# EAGLE design oscillator_board (EAGLE 9.0.0)
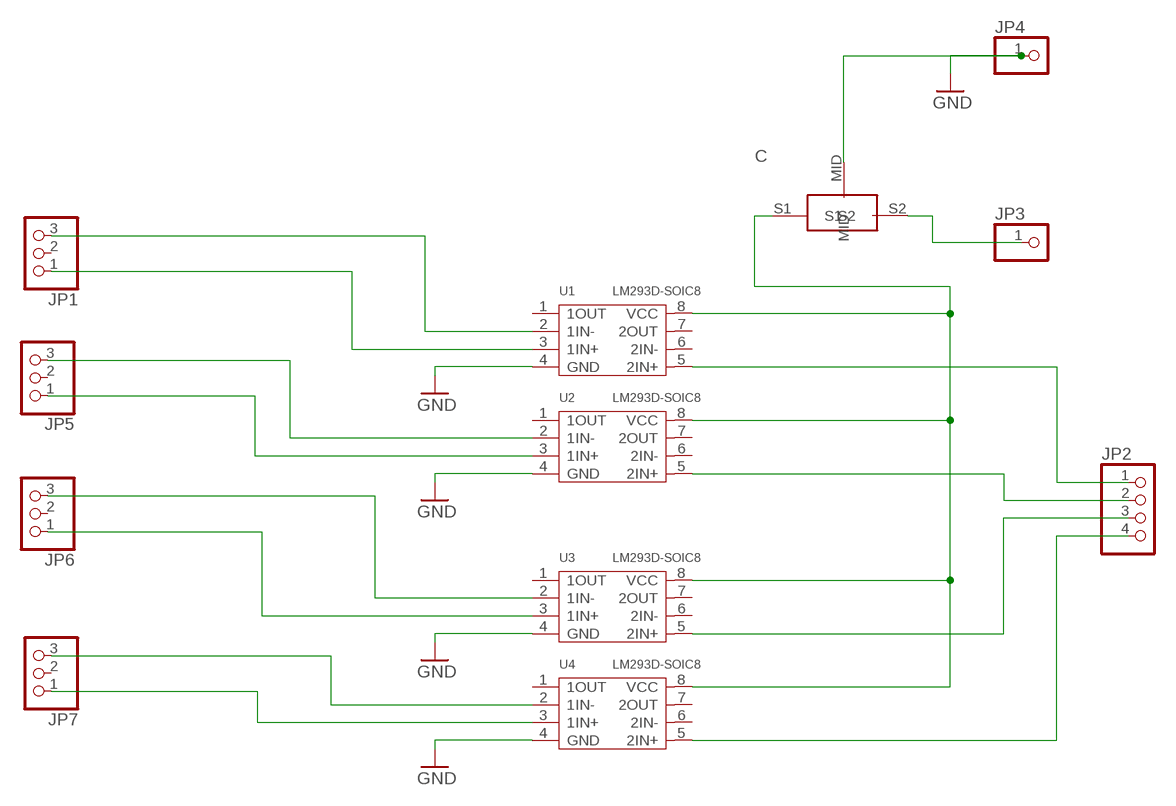
[diagram p0: schematic, sheet 1]

## Parts
JP1  PINHD-1X3  [1X03]
JP2  PINHD-1X4  [1X04]
JP3  PINHD-1X1  [1X01]
JP4  PINHD-1X1  [1X01]
JP5  PINHD-1X3  [1X03]
JP6  PINHD-1X3  [1X03]
JP7  PINHD-1X3  [1X03]
OSCILLATOR1  CSMD  [C]
U1  LM293D-SOIC8  AMPLIFIER-LM293D(SOIC8)  [SOIC8-1.27-5X4MM]
U2  LM293D-SOIC8  AMPLIFIER-LM293D(SOIC8)  [SOIC8-1.27-5X4MM]
U3  LM293D-SOIC8  AMPLIFIER-LM293D(SOIC8)  [SOIC8-1.27-5X4MM]
U4  LM293D-SOIC8  AMPLIFIER-LM293D(SOIC8)  [SOIC8-1.27-5X4MM]

## Nets
GND: JP4.1 OSCILLATOR1.MID U1.4(GND) U2.4(GND) U3.4(GND) U4.4(GND)
N$1: JP1.3 U1.2(1IN-)
N$2: JP1.1 U1.3(1IN+)
N$3: JP5.3 U2.2(1IN-)
N$4: JP5.1 U2.3(1IN+)
N$5: JP6.3 U3.2(1IN-)
N$6: JP6.1 U3.3(1IN+)
N$7: JP7.3 U4.2(1IN-)
N$8: JP7.1 U4.3(1IN+)
N$9: JP2.4 U4.5(2IN+)
N$10: JP2.3 U3.5(2IN+)
N$11: JP2.2 U2.5(2IN+)
N$12: JP2.1 U1.5(2IN+)
N$13: JP3.1 OSCILLATOR1.S2
VCC: OSCILLATOR1.S1 U1.8(VCC) U2.8(VCC) U3.8(VCC) U4.8(VCC)
Unconnected: JP1.2 JP5.2 JP6.2 JP7.2 U1.1(1OUT) U1.6(2IN-) U1.7(2OUT) U2.1(1OUT) U2.6(2IN-) U2.7(2OUT) U3.1(1OUT) U3.6(2IN-) U3.7(2OUT) U4.1(1OUT) U4.6(2IN-) U4.7(2OUT)

## Library data of the parts
JP1 JP5-JP7 = pinhead:PINHD-1X3: PIN HEADER
JP2 = pinhead:PINHD-1X4: PIN HEADER
JP3 JP4 = adafruit:PINHD-1X1: Pin header 1x1 for 0.1" spacing With round pins
OSCILLATOR1 = my-library:C
U1 = Seeed-IC:AMPLIFIER-LM293D(SOIC8): 310020016; MPN: LM293D; SPICEPREFIX: X
U2-U4 = Seeed-IC:AMPLIFIER-LM293D(SOIC8): 310020016; MPN: LM293D

## Board
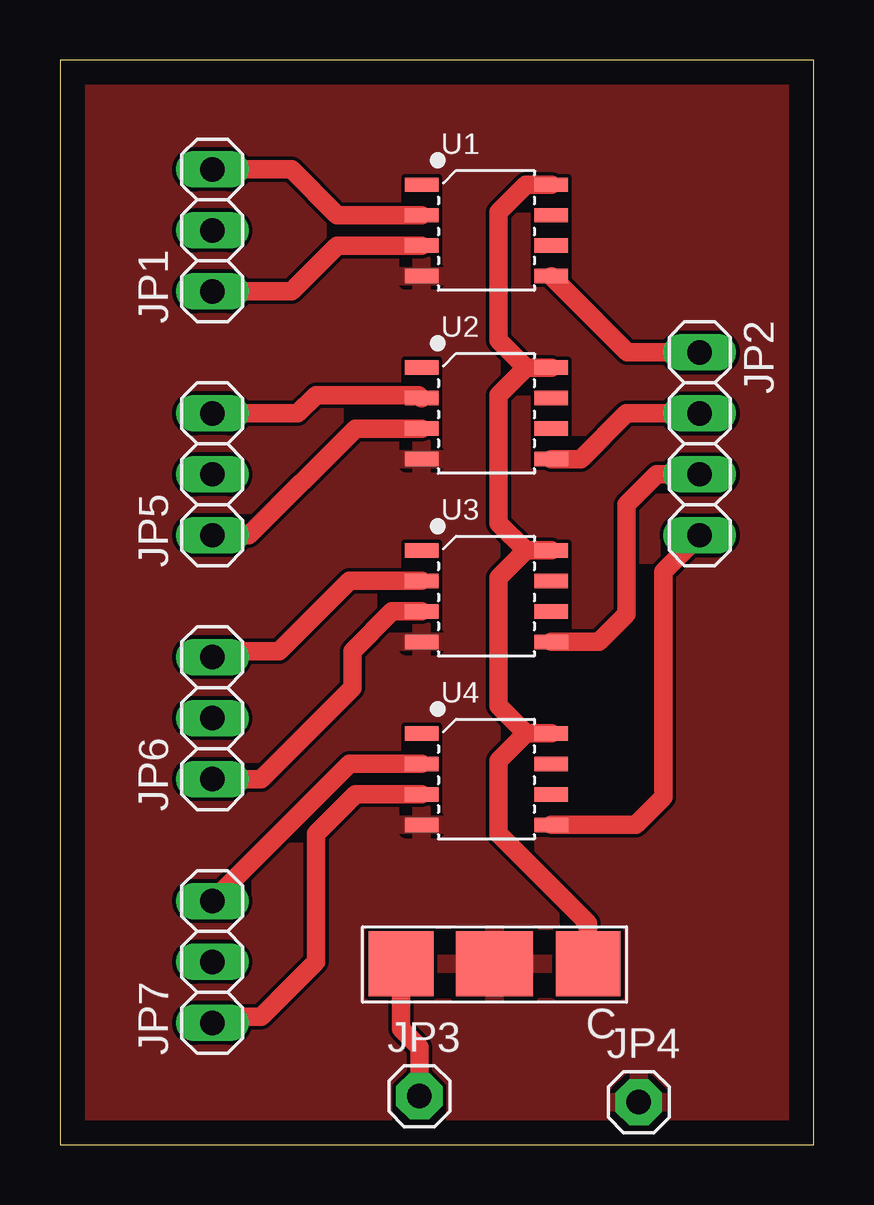
[diagram p1: board, top side]

Size 31.42 x 45.2 mm. Coordinates in mm from the lower left corner, seen from the top.
Outline: 0,0 31.42,0 31.42,45.2 0,45.2 0,0
Copper layers (1*16): Top 0.035mm / dielectric 1.5mm / Bottom 0.035mm
Design rules "default": minimum track width 6mil, minimum drill 0.35mm, track to track 6mil, track to pad 6mil, pad to pad 6mil, via to via 6mil, smd to smd 6mil, copper to edge 40mil, drill to drill 6mil, minimum pad ring 10mil, minimum via ring 8mil, stop-mask expansion 4mil, vias tented up to drill 0mil, thermal gap 10mil

### Footprints (pad centres in the part's own frame; a part is rotated, then mirrored left to right if it is on the bottom)
1X03 = drill 1.016 long: 1 -2.54,0; 2 0,0; 3 2.54,0
1X04 = drill 1.016 long: 1 -3.81,0; 2 -1.27,0; 3 1.27,0; 4 3.81,0
1X01 = drill 1.016 pad 1.93 octagon: 1 0,0
C = smd 3.2 x 2.7: MID 5.25,1.35 | smd 2.7 x 2.7: S1 1.35,1.35; S2 9.15,1.35
SOIC8-1.27-5X4MM = smd 0.6 x 1.4: 1 -1.905,-2.7; 2 -0.635,-2.7; 3 0.635,-2.7; 4 1.905,-2.7; 5 1.905,2.7; 6 0.635,2.7; 7 -0.635,2.7; 8 -1.905,2.7

### Placement (x,y rotation side)
JP1  6.35,38.1 90 top
JP2  26.67,29.21 270 top
JP3  14.99,2.03 0 top
JP4  24.13,1.78 0 top
JP5  6.35,27.94 90 top
JP6  6.35,17.78 90 top
JP7  6.35,7.62 90 top
OSCILLATOR1  23.37,8.89 180 top
U1  17.78,38.1 270 top
U2  17.78,30.48 270 top
U3  17.78,22.86 270 top
U4  17.78,15.24 270 top

### Tracks (layer width: path | path; a pad name or v marks a point on that pad's centre or on a via)
GND
  pour Top: 12.95,-2.29 -1.52,-2.29 -1.52,35.81 -1.52,51.05 37.34,51.05 37.34,-2.29
N$1
  Top 0.762: JP1.3 9.65,40.64 11.56,38.73 U1.2
N$2
  Top 0.762: U1.3 11.56,37.47 9.65,35.56 JP1.1
N$3
  Top 0.762: JP5.3 9.91,30.48 10.67,31.24 14.95,31.24 U2.2
N$4
  Top 0.762: JP5.1 7.87,25.4 12.32,29.84 U2.3
N$5
  Top 0.762: JP6.3 6.6,20.57 9.14,20.57 12.06,23.5 U3.2
N$6
  Top 0.762: JP6.1 8.38,15.24 12.19,19.05 12.19,20.57 13.84,22.23 U3.3
N$7
  Top 0.762: JP7.3 12.06,15.88 U4.2
N$8
  Top 0.762: JP7.1 6.6,5.33 8.38,5.33 10.67,7.62 10.67,12.95 12.32,14.61 U4.3
N$9
  Top 0.762: JP2.4 25.15,23.88 25.15,14.48 24,13.34 U4.5
N$10
  Top 0.762: U3.5 22.48,20.95 23.62,22.1 23.62,26.67 24.89,27.94 JP2.3
N$11
  Top 0.762: U2.5 21.72,28.57 23.62,30.48 JP2.2
N$12
  Top 0.762: U1.5 23.66,33.02 JP2.1
N$13
  Top 0.152: 14.94,2.13 JP3.1
  Top 0.762: OSCILLATOR1.S2 14.22,4.83 14.99,4.06 JP3.1
VCC
  Top 0.762: OSCILLATOR1.S1 22.02,9.22 18.29,12.95 18.29,16 19.43,17.14 | 19.43,17.14 U4.8 | 19.43,17.14 18.29,18.29 18.29,23.62 19.43,24.77 | 19.43,24.77 U3.8 | 19.43,24.77 18.29,25.91 18.29,31.24 19.43,32.38 | 19.43,32.38 U2.8 | 19.43,32.38 18.29,33.53 18.29,38.86 19.43,40.01 U1.8